# EAGLE schematic 3.3to10DC (EAGLE 9.6.2)
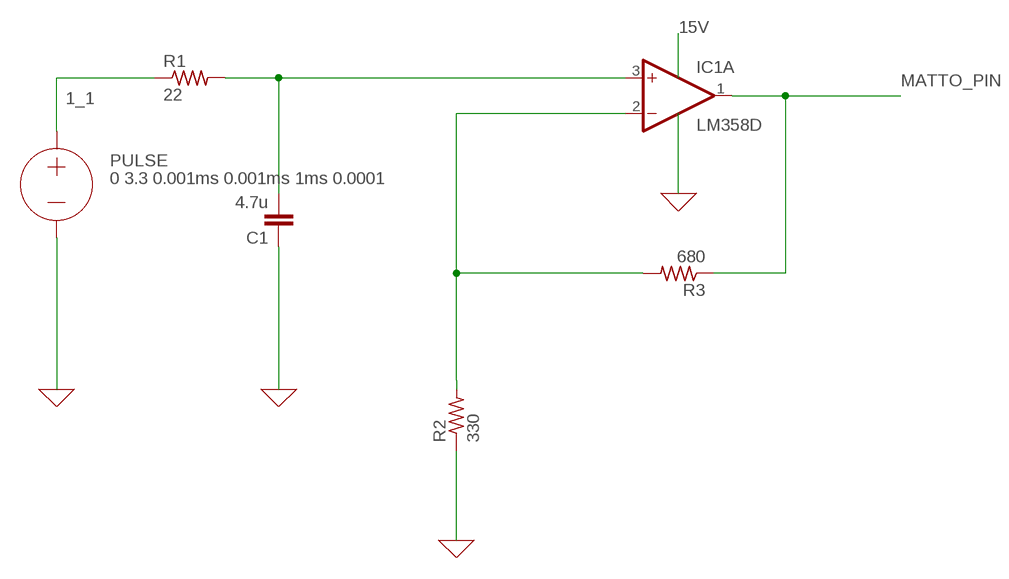
[diagram p0: schematic, sheet 1]

## Parts
C1  4.7u  C2.5/2  [C2.5-2]
IC1  LM358D  [SO08]
PULSE  0 3.3 0.001ms 0.001ms 1ms 0.0001  VOLTAGE  (no package)
R1  22  R-US_0204/7  [0204/7]
R2  330  R-US_0204/7  [0204/7]
R3  680  R-US_0204/7  [0204/7]

## Nets
0: C1.1 PULSE.- R2.1 ; supply symbol labelled GND
1_1: PULSE.+ R1.1
MATTO_PIN: IC1.1(A:OUT) R3.1
N$2: C1.2 IC1.3(A:+IN) R1.2
N$3: IC1.2(A:-IN) R2.2 R3.2
Unconnected: IC1.5(B:+IN) IC1.6(B:-IN) IC1.7(B:OUT)

## Power pins joined to a net without a drawn wire
V+: IC1.8(P:V+)
V-: IC1.4(P:V-)

## Library data of the parts
C1 = capacitor-wima:C: CAPACITOR naming: grid - package width
IC1 = linear:LM358: OP AMP also LM158; LM258; LM2904 Source: http://cache.national.com/ds/LM/LM158.pdf
PULSE = ngspice-simulation:VOLTAGE: Independent Voltage Source, either DC, AC, PULSE, SINE, PWL, EXP, or SFFM; VALUE: 0V
R1-R3 = rcl:R-US_: RESISTOR, American symbol; SPICEPREFIX: R